# EAGLE design 2 Motors_V3 (EAGLE 9.6.2)
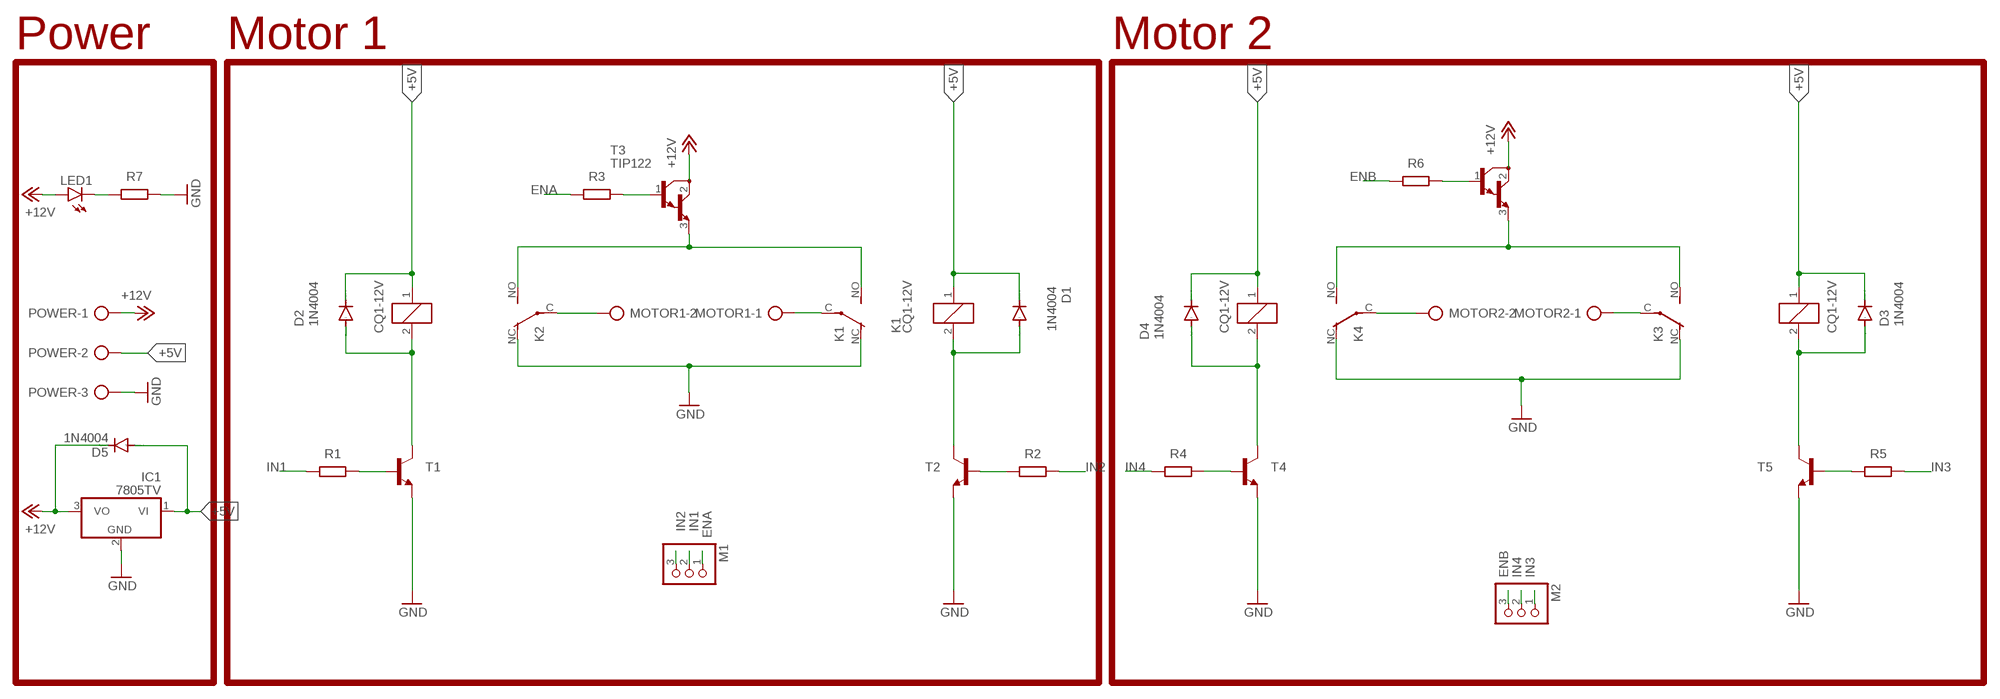
[diagram p0: schematic, sheet 1]

## Parts
D1  1N4004  [DO41-10]
D2  1N4004  [DO41-10]
D3  1N4004  [DO41-10]
D4  1N4004  [DO41-10]
D5  1N4004  [DO41-10]
IC1  7805TV  [TO220V]
K1  CQ1-12V  [CQ1]
K2  CQ1-12V  [CQ1]
K3  CQ1-12V  [CQ1]
K4  CQ1-12V  [CQ1]
LED1  LED3MM  [LED3MM]
M1  PINHD-1X3  [1X03]
M2  PINHD-1X3  [1X03]
MOTOR1  AK300/2  [AK300/2]
MOTOR2  AK300/2  [AK300/2]
POWER  AK300/3  [AK300/3]
R1  4.7k  R-EU_0204/7  [0204/7]
R2  4.7k  R-EU_0204/7  [0204/7]
R3  4.7k  R-EU_0204/7  [0204/7]
R4  4.7k  R-EU_0204/7  [0204/7]
R5  4.7k  R-EU_0204/7  [0204/7]
R6  4.7k  R-EU_0204/7  [0204/7]
R7  330  R-EU_0204/7  [0204/7]
T1  2N2222-NPN-TO92-EBC  [TO92-EBC]
T2  2N2222-NPN-TO92-EBC  [TO92-EBC]
T3  TIP122  [TO220]
T4  2N2222-NPN-TO92-EBC  [TO92-EBC]
T5  2N2222-NPN-TO92-EBC  [TO92-EBC]
T6  TIP122  [TO220]

## Nets
+5V: D1.C D2.C D3.C D4.C D5.A IC1.1(VI) K1.1 K2.1 K3.1 K4.1 POWER.2
+12V: D5.C IC1.3(VO) LED1.A POWER.1 T3.2(C) T6.2(C)
ENA: M1.1 R3.2
ENB: M2.3 R6.2
GND: IC1.2(GND) K1.NC(2:O) K2.NC(2:O) K3.NC(2:O) K4.NC(2:O) POWER.3 R7.2 T1.E T2.E T4.E T5.E
IN1: M1.2 R1.1
IN2: M1.3 R2.1
IN3: M2.1 R5.1
IN4: M2.2 R4.2
N$1: K2.C(2:P) MOTOR1.2
N$2: K1.NO(2:S) K2.NO(2:S) T3.3(E)
N$3: D2.A K2.2 T1.C
N$4: LED1.K(C) R7.1
N$5: K1.C(2:P) MOTOR1.1
N$6: D1.A K1.2 T2.C
N$7: D3.A K3.2 T5.C
N$8: K3.NO(2:S) K4.NO(2:S) T6.3(E)
N$9: D4.A K4.2 T4.C
N$14: K3.C(2:P) MOTOR2.1
N$16: K4.C(2:P) MOTOR2.2
T1: R1.2 T1.B
T2: R2.2 T2.B
T3: R3.1 T3.1(B)
T4: R4.1 T4.B
T5: R5.2 T5.B
T6: R6.1 T6.1(B)

## Notes on the sheet
- Power | Motor 1 | Motor 2

## Library data of the parts
D1-D5 = diode:1N4004: DIODE general purpose rectifier, 1 A
IC1 = linear:78*: Positive VOLTAGE REGULATOR Source: http://cache.national.com/ds/LM/LM78L05.pdf http://www.fairchildsemi.com/ds/LM/LM7805.pdf
K1-K4 = relay:CQ1-12V: AUTOMOTIVE QUIET RELAY NAiS Source: http://www.mew-europe.com/.. en_ds_61208_0000.pdf; OC_FARNELL: unknown; OC_NEWARK: unknown
LED1 = led:LED: LED OSRAM: - CHIPLED LG R971, LG N971, LY N971, LG Q971, LY Q971, LO R971, LY R971 LH N974, LH R974 LS Q976, LO Q976, LY Q976 LO Q996 - Hyper CHIPLED LW Q18S LB Q993, LB Q99A, LB R99A - SideLED LS A670, LO A670, LY A670, LG A670, LP A670 LB A673, LV A673, LT A673, LW A673 LH A674 LY A675 LS A676, LA A676, LO A676, LY A676, LW A676 LS A679, LY A679, LG A679 - Hyper Micro SIDELED® LS Y876, LA Y876, LO Y876, LY Y876 LT Y87S - SmartLED LW L88C, LW L88S LB L89C, LB L89S, LG L890 LS L89K, LO L89K, LY L89K LS L896, LA L896, LO L896, LY L896 - TOPLED LS T670, LO T670, LY T670, LG T670, LP T670 LSG T670, LSP T670, LSY T670, LOP T670, LYG T670 LG T671, LOG T671, LSG T671 LB T673, LV T673, LT T673, LW T673 LH T674 LS T676, LA T676, LO T676, LY T676, LB T676, LH T676, LSB T676, LW T676 LB T67C, LV T67C, LT T67C, LS T67K, LO T67K, LY T67K, LW E67C LS E67B, LA E67B, LO E67B, LY E67B, LB E67C, LV E67C, LT E67C LW T67C LS T679, LY T679, LG T679 LS T770, LO T770, LY T770, LG T770, LP T770 LB T773, LV T773, LT T773, LW T773 LH T774 LS E675, LA E675, LY E675, LS T675 LS T776, LA T776, LO T776, LY T776, LB T776 LHGB T686 LT T68C, LB T68C - Hyper Mini TOPLED® LB M676 - Mini TOPLED Santana® LG M470 LS M47K, LO M47K, LY M47K Source: http://www.osram.convergy.de LUXEON: - LUMILED® LXK2-PW12-R00, LXK2-PW12-S00, LXK2-PW14-U00, LXK2-PW14-V00 LXK2-PM12-R00, LXK2-PM12-S00, LXK2-PM14-U00 LXK2-PE12-Q00, LXK2-PE12-R00, LXK2-PE12-S00, LXK2-PE14-T00, LXK2-PE14-U00 LXK2-PB12-K00, LXK2-PB12-L00, LXK2-PB12-M00, LXK2-PB14-N00, LXK2-PB14-P00, LXK2-PB14-Q00 LXK2-PR12-L00, LXK2-PR12-M00, LXK2-PR14-Q00, LXK2-PR14-R00 LXK2-PD12-Q00, LXK2-PD12-R00, LXK2-PD12-S00 LXK2-PH12-R00, LXK2-PH12-S00 LXK2-PL12-P00, LXK2-PL12-Q00, LXK2-PL12-R00 Source: www.luxeon.com KINGBRIGHT: KA-3528ASYC Source: www.kingbright.com
M1 M2 = pinhead:PINHD-1X3: PIN HEADER
MOTOR1 MOTOR2 = con-ptr500:AK300/2: CONNECTOR; OC_FARNELL: unknown; OC_NEWARK: unknown
POWER = con-ptr500:AK300/3: CONNECTOR; OC_FARNELL: unknown; OC_NEWARK: unknown
R1-R7 = rcl:R-EU_: RESISTOR, European symbol; SPICEPREFIX: R
T1 T2 T4 T5 = transistor-neu-to92:*-NPN-: NPN Transistror
T3 T6 = transistor:TIP122: NPN BIPOLAR DARLINGTON TRANSISTOR

## Board
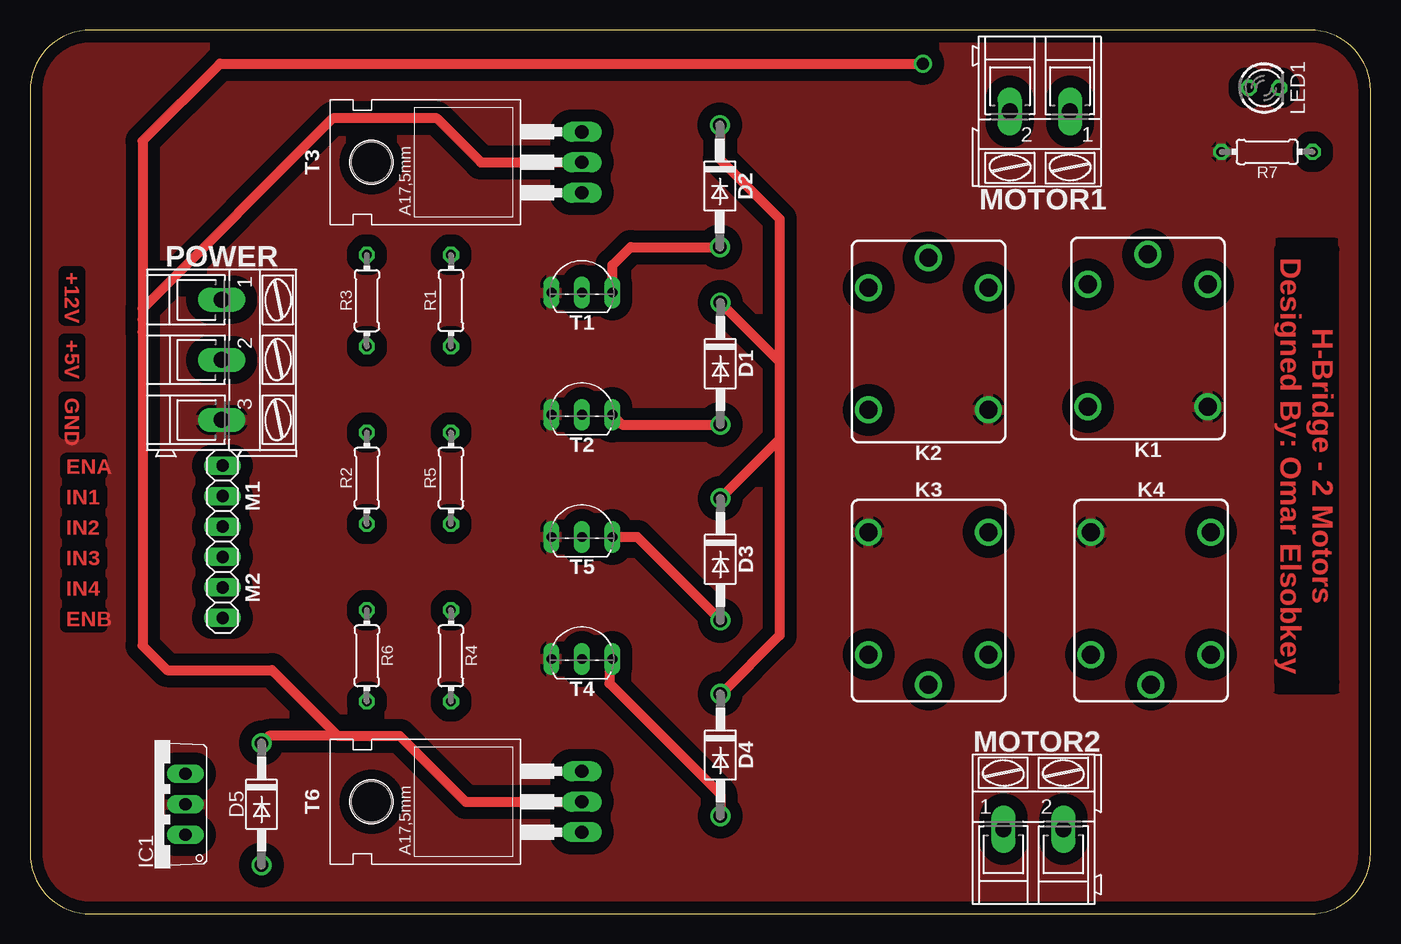
[diagram p1: board, top side]
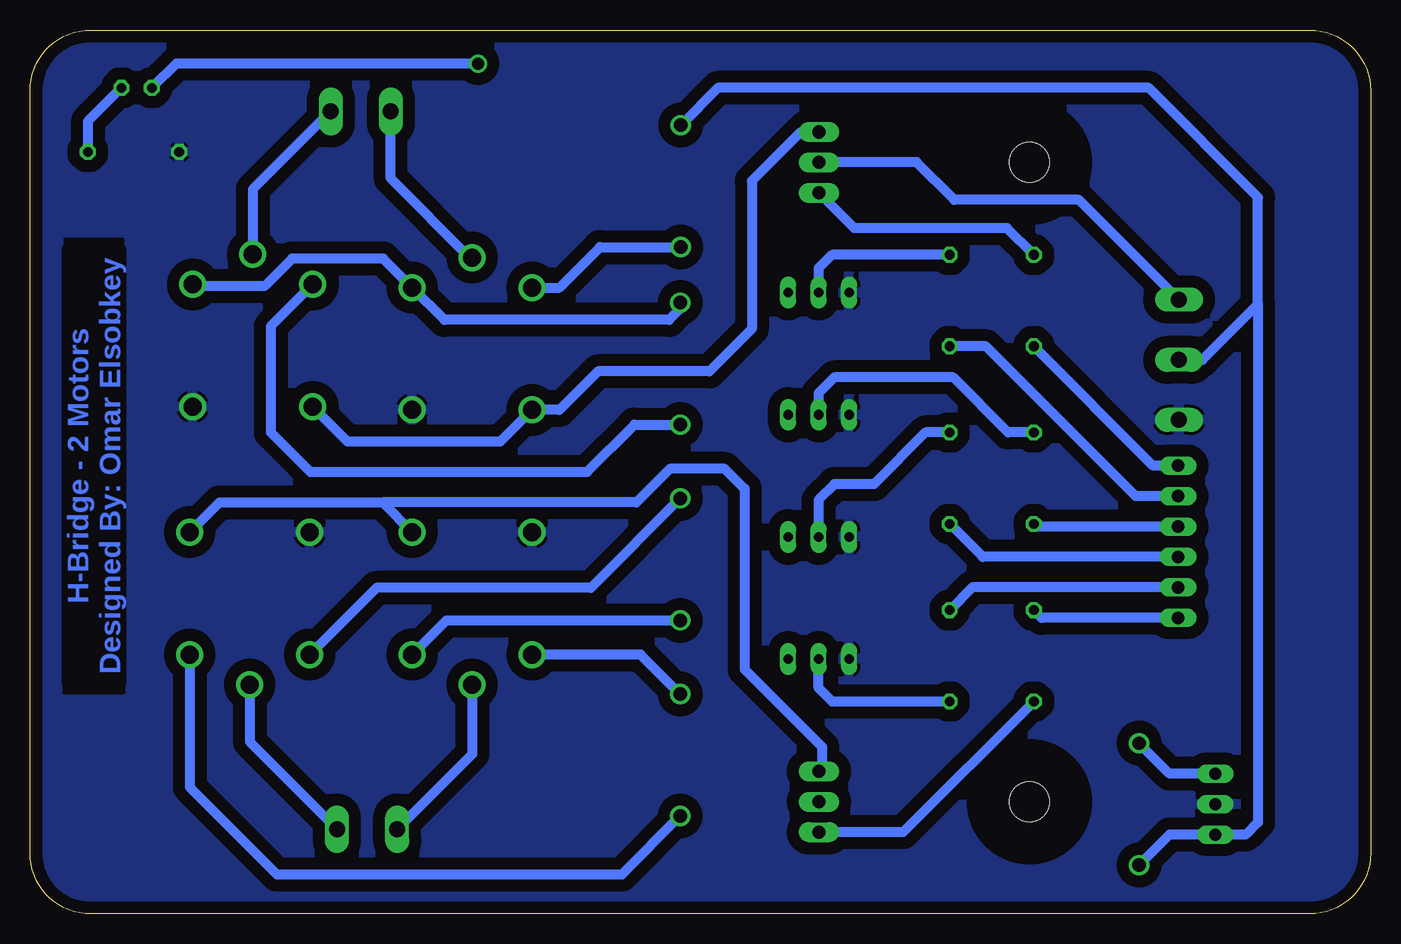
[diagram p2: board, bottom side, seen from below]

Size 111.76 x 73.66 mm. Coordinates in mm from the lower left corner, seen from the top.
Outline: 5.08,0 106.68,0 arc90 111.76,5.08 111.76,68.58 arc90 106.68,73.66 5.08,73.66 arc90 0,68.58 0,5.08 arc90 5.08,0
Copper layers (1*16): Top 0.035mm / dielectric 1.5mm / Bottom 0.035mm
Design rules "default *": minimum track width 32mil, minimum drill 0.35mm, track to track 16mil, track to pad 16mil, pad to pad 6mil, via to via 6mil, smd to smd 6mil, copper to edge 40mil, drill to drill 6mil, minimum pad ring 10mil, minimum via ring 8mil, stop-mask expansion 4mil, vias tented up to drill 0mil, thermal gap 10mil

### Footprints (pad centres in the part's own frame; a part is rotated, then mirrored left to right if it is on the bottom)
DO41-10 = drill 1.118: A 5.08,0; C -5.08,0
TO220V = drill 1.016 long: 1 -2.54,-2.54; 2 0,-2.54; 3 2.54,-2.54
CQ1 = drill 1.5: 1 4.5,-5; 2 4.5,5; C 7,0; NC -5.7,-5; NO -5.7,5
LED3MM = drill 0.813 octagon: A -1.27,0; K 1.27,0
1X03 = drill 1.016 long: 1 -2.54,0; 2 0,0; 3 2.54,0
AK300/2 = drill 1.321 long: 1 -2.515,0; 2 2.489,0
AK300/3 = drill 1.321 long: 1 -5.004,0; 2 0,0; 3 5.004,0
0204/7 = drill 0.813 octagon: 1 -3.81,0; 2 3.81,0
TO92-EBC = drill 0.813 long: B 0,-1.27; C 2.54,-1.27; E -2.54,-1.27
TO220 = drill 1.118 long: 1 -2.54,-6.35; 2 0,-6.35; 3 2.54,-6.35 | hole 3.302: 0,11.176

### Placement (x,y rotation side)
D1  57.56,45.86 270 top
D2  57.51,60.66 270 top
D3  57.56,29.55 270 top
D4  57.56,13.24 270 top
D5  19.3,9.14 270 top
IC1  10.41,9.14 90 top
K1  93.19,47.96 90 top
K2  74.9,47.7 90 top
K3  74.9,26.11 270 top
K4  93.45,26.11 270 top
LED1  102.87,68.83 0 top
M1  16.05,34.82 270 top
M2  16.05,27.2 270 top
MOTOR1  84.18,66.88 180 top
MOTOR2  83.67,7.06 0 top
POWER  15.98,46.18 270 top
R1  35.09,51.11 90 top
R2  28.08,36.31 90 top
R3  28.08,51.11 270 top
R4  35.09,21.51 90 top
R5  35.09,36.31 90 top
R6  28.08,21.51 90 top
R7  103.12,63.5 180 top
T1  46.01,53.05 0 top
T2  46.01,42.86 0 top
T3  39.64,62.64 90 top
T4  46.01,22.52 0 top
T5  46.01,32.69 0 top
T6  39.64,9.35 90 top

### Tracks (layer width: path | path; a pad name or v marks a point on that pad's centre or on a via)
+5V
  Top 0.813: 62.48,46.01 62.48,57.91 57.51,62.89 D2.C | 62.48,46.01 62.48,39.56 | 62.48,39.56 62.48,23.22 57.59,18.32 D4.C | D3.C 62.48,39.56 | D1.C 62.48,46.01
  Bottom 0.813: 9.38,50.81 14.02,46.18 POWER.2 | D2.C 54.41,68.83 18.5,68.83 9.38,59.72 9.38,50.81 | D1.C 57.56,50.43 58.48,49.5 77.2,49.5 K2.1 82.31,54.61 89.92,54.61 92.2,52.32 98.06,52.32 K1.1 | K3.1 60.85,21.61 D4.C | D3.C 65.01,27.18 82.88,27.18 K4.1 | 9.38,50.81 9.38,7.63 10.41,6.6 IC1.1 16.76,6.6 D5.A
+12V  (via drill 1)
  Top 0.813: T3.2 37.59,62.64 33.93,66.29 25.23,66.29 9.38,50.44 | T6.2 36.32,9.35 30.83,14.84 25.65,14.84 | 25.65,14.84 20.17,20.32 11.43,20.32 9.38,22.36 9.38,48.51 9.38,49.54 9.38,50.44 | 25.65,14.84 19.92,14.84 D5.C | v74.42,70.87 15.84,70.87 9.38,64.41 9.38,50.44
  Bottom 0.813: T3.2 45.97,62.65 37.85,62.65 34.71,59.51 24.31,59.51 POWER.1 | LED1.A 99.57,70.87 v74.42,70.87 | IC1.3 16.76,11.68 D5.C
ENA
  Bottom 0.813: M1.1 18.14,37.36 R3.2
ENB
  Bottom 0.813: M2.3 27.43,24.66 R6.2
GND
  pour Bottom (isolate 1.016): -2.26,74.96 114.1,74.96 114.1,-1.45 -2.26,-1.45
  pour Top (isolate 1.016): -4.29,77.24 117.14,77.24 117.14,-3.73 -4.29,-3.73
IN1
  Bottom 0.813: M1.2 19.58,34.82 32.06,47.3 R1.1
IN2
  Bottom 0.813: M1.3 27.87,32.28 R2.1
IN3
  Bottom 0.813: M2.1 32.33,29.74 R5.1
IN4
  Bottom 0.813: M2.2 33.2,27.2 R4.2
N$1
  Bottom 0.813: K2.C 75.1,54.7 81.69,61.29 MOTOR1.2
N$2
  Bottom 0.813: K1.NO 85.31,39.37 72.54,39.37 K2.NO 67.62,42 64.41,45.21 55.12,45.21 51.58,48.75 51.58,61.08 47.48,65.18 T3.3
N$3
  Top 0.813: D2.A 50.06,55.58 48.55,54.06 T1.C
  Bottom 0.813: K2.2 67.62,52.2 64.25,55.58 D2.A
N$4
  Bottom 0.813: LED1.K 106.93,66.04 R7.1
N$5
  Bottom 0.813: MOTOR1.1 93.19,60.38 K1.C
N$6
  Top 0.813: T2.C 49.37,40.77 D1.A
  Bottom 0.813: K1.2 91.69,48.95 91.69,40.13 88.39,36.83 65.31,36.83 61.37,40.77 D1.A
N$7
  Top 0.813: T5.C 50.61,31.42 D3.A
  Bottom 0.813: K3.2 77.05,24.47 D3.A
N$8
  Bottom 0.813: K4.NO 95.97,34.29 82.38,34.29 | 82.38,34.29 K3.NO | 82.38,34.29 61.21,34.29 58.42,37.08 53.85,37.08 52.2,35.43 52.2,20.38 45.73,13.92 45.73,12.14 T6.3
N$9
  Top 0.813: T4.C 48.3,20.99 48.3,19.21 57.56,9.96 D4.A
  Bottom 0.813: K4.2 98.45,10.56 91.19,3.3 62.42,3.3 D4.A
N$14
  Bottom 0.813: K3.C 74.91,13.31 MOTOR2.1
N$16
  Bottom 0.813: K4.C 93.45,14.35 MOTOR2.2
NAMES
  pour Top (isolate 0.508): 102.13,55.91 111.05,55.91 111.05,18.87 102.13,18.87
  pour Bottom (isolate 0.508): 102.13,55.91 111.05,55.91 111.05,18.87 102.13,18.87
  pour Top (isolate 0.508): 1.3,55.65 7.42,55.65 7.42,22.43 1.3,22.43
T1
  Bottom 0.813: 46.09,51.7 T1.B 46.01,53.81 44.9,54.92 R1.2
T2
  Bottom 0.813: R2.2 28.1,40.13 30.23,40.13 34.8,44.7 44.7,44.7 46.01,43.4 T2.B
T3
  Bottom 0.813: R3.1 30.31,57.15 43.04,57.15 T3.1
T4
  Bottom 0.813: R4.1 44.88,17.7 46.01,18.83 T4.B
T5
  Bottom 0.813: R5.2 37.1,40.12 41.4,35.81 44.7,35.81 46.01,34.51 T5.B
T6
  Bottom 0.813: R6.1 38.97,6.81 T6.1

### Text on the board
Top: +12V | +5V | GND | ENA | H-Bridge - 2 Motors / Designed By: Omar Elsobkey | IN1 | IN2 | IN3 | IN4 | ENB
Bottom: H-Bridge - 2 Motors / Designed By: Omar Elsobkey